# EAGLE design Placa Principal VF (EAGLE 9.7.0)
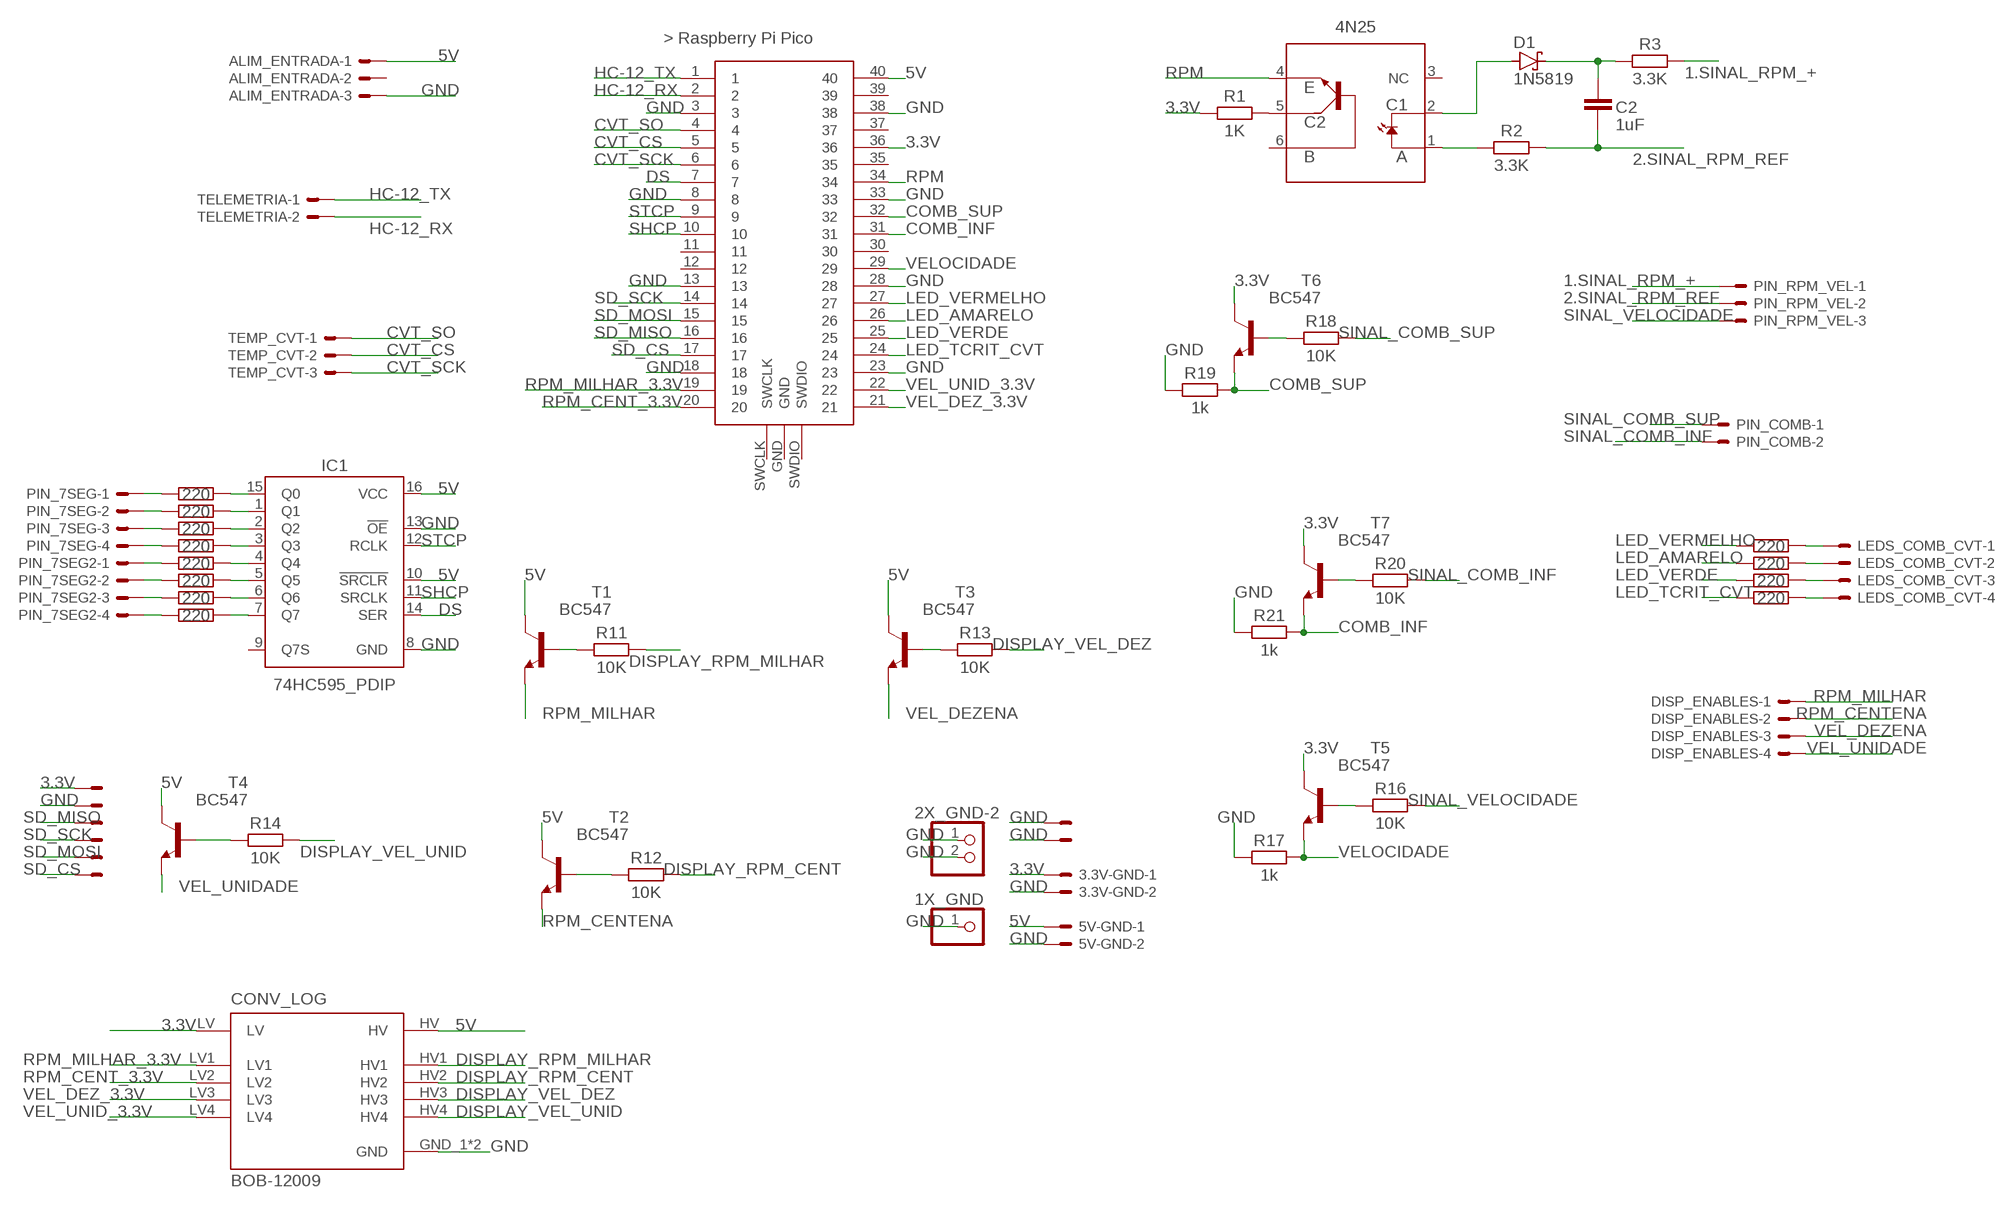
[diagram p0: schematic, sheet 1]

## Parts
1X_GND  PINHD-1X1  [1X01]
2X_GND  JST-XH-02-PIN-ROUND-PAD  [JST-XH-02-PACKAGE-ROUND-PAD]
2X_GND-2  PINHD-1X2  [1X02]
3.3V  JST-XH-02-PIN-ROUND-PAD  [JST-XH-02-PACKAGE-ROUND-PAD]
3.3V-GND  JST-XH-02-PIN-ROUND-PAD  [JST-XH-02-PACKAGE-ROUND-PAD]
4N25  4N25  [DIP762W60P254L712H480Q6B]
5V-GND  JST-XH-02-PIN-ROUND-PAD  [JST-XH-02-PACKAGE-ROUND-PAD]
ALIM_ENTRADA  JST-XH-03-PIN-ROUND-PAD  [JST-XH-03-PACKAGE-ROUND-PAD]
C2  1uF  C_RADIAL-12.5MM-DIA  [CAPRD550W60D1025H1250B]
CONV_LOG  BOB-12009  [CONV_BOB-12009]
D1  1N5819  1N5817-B  [DO41-7.6]
DISP_ENABLES  JST-XH-04-PIN-ROUND-PAD  [JST-XH-04-PACKAGE-ROUND-PAD]
IC1  74HC595_PDIP  [DIP762W53P254L1969H508Q16B]
LEDS_COMB_CVT  JST-XH-04-PIN-ROUND-PAD  [JST-XH-04-PACKAGE-ROUND-PAD]
MOD_SD  JST-XH-04-PIN-ROUND-PAD  [JST-XH-04-PACKAGE-ROUND-PAD]
PIN_7SEG  JST-XH-04-PIN-ROUND-PAD  [JST-XH-04-PACKAGE-ROUND-PAD]
PIN_7SEG2  JST-XH-04-PIN-ROUND-PAD  [JST-XH-04-PACKAGE-ROUND-PAD]
PIN_COMB  JST-XH-02-PIN-ROUND-PAD  [JST-XH-02-PACKAGE-ROUND-PAD]
PIN_RPM_VEL  JST-XH-03-PIN-ROUND-PAD  [JST-XH-03-PACKAGE-ROUND-PAD]
R1  1K  R_AXIAL-7.2MM-PITCH  [RESAD724W46L381D178B]
R2  3.3K  R_AXIAL-7.2MM-PITCH  [RESAD724W46L381D178B]
R3  3.3K  R_AXIAL-7.2MM-PITCH  [RESAD724W46L381D178B]
R4  220  R_AXIAL-7.2MM-PITCH  [RESAD724W46L381D178B]
R5  220  R_AXIAL-7.2MM-PITCH  [RESAD724W46L381D178B]
R6  220  R_AXIAL-7.2MM-PITCH  [RESAD724W46L381D178B]
R7  220  R_AXIAL-7.2MM-PITCH  [RESAD724W46L381D178B]
R8  220  R_AXIAL-7.2MM-PITCH  [RESAD724W46L381D178B]
R9  220  R_AXIAL-7.2MM-PITCH  [RESAD724W46L381D178B]
R10  220  R_AXIAL-7.2MM-PITCH  [RESAD724W46L381D178B]
R11  10K  R_AXIAL-7.2MM-PITCH  [RESAD724W46L381D178B]
R12  10K  R_AXIAL-7.2MM-PITCH  [RESAD724W46L381D178B]
R13  10K  R_AXIAL-7.2MM-PITCH  [RESAD724W46L381D178B]
R14  10K  R_AXIAL-7.2MM-PITCH  [RESAD724W46L381D178B]
R15  220  R_AXIAL-7.2MM-PITCH  [RESAD724W46L381D178B]
R16  10K  R_AXIAL-7.2MM-PITCH  [RESAD724W46L381D178B]
R17  1k  R_AXIAL-7.2MM-PITCH  [RESAD724W46L381D178B]
R18  10K  R_AXIAL-7.2MM-PITCH  [RESAD724W46L381D178B]
R19  1k  R_AXIAL-7.2MM-PITCH  [RESAD724W46L381D178B]
R20  10K  R_AXIAL-7.2MM-PITCH  [RESAD724W46L381D178B]
R21  1k  R_AXIAL-7.2MM-PITCH  [RESAD724W46L381D178B]
R22  220  R_AXIAL-7.2MM-PITCH  [RESAD724W46L381D178B]
R23  220  R_AXIAL-7.2MM-PITCH  [RESAD724W46L381D178B]
R24  220  R_AXIAL-7.2MM-PITCH  [RESAD724W46L381D178B]
R25  220  R_AXIAL-7.2MM-PITCH  [RESAD724W46L381D178B]
T1  BC547  [TO92]
T2  BC547  [TO92]
T3  BC547  [TO92]
T4  BC547  [TO92]
T5  BC547  [TO92]
T6  BC547  [TO92]
T7  BC547  [TO92]
TELEMETRIA  JST-XH-02-PIN-ROUND-PAD  [JST-XH-02-PACKAGE-ROUND-PAD]
TEMP_CVT  JST-XH-03-PIN-ROUND-PAD  [JST-XH-03-PACKAGE-ROUND-PAD]
U$2  RASPBERRY-PI-PICO_TH  [FT_RASPBERRY-PI-PICO_TH]

## Nets
1.SINAL_RPM_+: PIN_RPM_VEL.1 R3.2
2.SINAL_RPM_REF: C2.2 PIN_RPM_VEL.2 R2.2
3.3V: 3.3V-GND.1 3.3V.1 CONV_LOG.LV R1.1 T5.3(C) T6.3(C) T7.3(C) U$2.36
5V: 5V-GND.1 ALIM_ENTRADA.1 CONV_LOG.HV IC1.10(!SRCLR) IC1.16(VCC) T1.3(C) T2.3(C) T3.3(C) T4.3(C) U$2.40
COMB_INF: R21.2 T7.1(E) U$2.31
COMB_SUP: R19.2 T6.1(E) U$2.32
CVT_CS: TEMP_CVT.2 U$2.5
CVT_SCK: TEMP_CVT.3 U$2.6
CVT_SO: TEMP_CVT.1 U$2.4
DISPLAY_RPM_CENT: CONV_LOG.HV2 R12.2
DISPLAY_RPM_MILHAR: CONV_LOG.HV1 R11.2
DISPLAY_VEL_DEZ: CONV_LOG.HV3 R13.2
DISPLAY_VEL_UNID: CONV_LOG.HV4 R14.2
DS: IC1.14(SER) U$2.7
GND: 1X_GND.1 2X_GND-2.1 2X_GND-2.2 2X_GND.1 2X_GND.2 3.3V-GND.2 3.3V.2 5V-GND.2 ALIM_ENTRADA.3 CONV_LOG.GND_1(GND) CONV_LOG.GND_2(GND) IC1.8(GND) IC1.13(!OE) R17.1 R19.1 R21.1 U$2.3 U$2.8 U$2.13 U$2.18 U$2.23 U$2.28 U$2.33 U$2.38
HC-12_RX: TELEMETRIA.2 U$2.2
HC-12_TX: TELEMETRIA.1 U$2.1
LED_AMARELO: R22.1 U$2.26
LED_TCRIT_CVT: R24.1 U$2.24
LED_VERDE: R23.1 U$2.25
LED_VERMELHO: R15.1 U$2.27
N$1: 4N25.2(C1) D1.A
N$2: 4N25.1(A) R2.1
N$3: R16.1 T5.2(B)
N$4: C2.1 D1.C R3.1
N$5: R11.1 T1.2(B)
N$6: 4N25.5(C2) R1.2
N$7: IC1.15(Q0) R4.2
N$8: IC1.1(Q1) R5.2
N$9: IC1.2(Q2) R6.2
N$10: LEDS_COMB_CVT.1 R15.2
N$11: R12.1 T2.2(B)
N$12: IC1.3(Q3) R7.2
N$13: IC1.4(Q4) R8.2
N$14: R13.1 T3.2(B)
N$15: IC1.5(Q5) R9.2
N$16: R18.1 T6.2(B)
N$17: LEDS_COMB_CVT.2 R22.2
N$18: R14.1 T4.2(B)
N$19: IC1.6(Q6) R10.2
N$20: LEDS_COMB_CVT.3 R23.2
N$21: R20.1 T7.2(B)
N$22: LEDS_COMB_CVT.4 R24.2
N$23: IC1.7(Q7) R25.2
N$24: PIN_7SEG.1 R4.1
N$25: PIN_7SEG.2 R5.1
N$26: PIN_7SEG.3 R6.1
N$27: PIN_7SEG.4 R7.1
N$28: PIN_7SEG2.1 R8.1
N$29: PIN_7SEG2.2 R9.1
N$30: PIN_7SEG2.3 R10.1
N$31: PIN_7SEG2.4 R25.1
RPM: 4N25.4(E) U$2.34
RPM_CENT_3.3V: CONV_LOG.LV2 U$2.20
RPM_CENTENA: DISP_ENABLES.2 T2.1(E)
RPM_MILHAR: DISP_ENABLES.1 T1.1(E)
RPM_MILHAR_3.3V: CONV_LOG.LV1 U$2.19
SD_CS: MOD_SD.4 U$2.17
SD_MISO: MOD_SD.1 U$2.16
SD_MOSI: MOD_SD.3 U$2.15
SD_SCK: MOD_SD.2 U$2.14
SHCP: IC1.11(SRCLK) U$2.10
SINAL_COMB_INF: PIN_COMB.2 R20.2
SINAL_COMB_SUP: PIN_COMB.1 R18.2
SINAL_VELOCIDADE: PIN_RPM_VEL.3 R16.2
STCP: IC1.12(RCLK) U$2.9
VEL_DEZ_3.3V: CONV_LOG.LV3 U$2.21
VEL_DEZENA: DISP_ENABLES.3 T3.1(E)
VEL_UNID_3.3V: CONV_LOG.LV4 U$2.22
VEL_UNIDADE: DISP_ENABLES.4 T4.1(E)
VELOCIDADE: R17.2 T5.1(E) U$2.29
Unconnected: 4N25.3(NC) 4N25.6(B) ALIM_ENTRADA.2 IC1.9(Q7S) U$2.11 U$2.12 U$2.30 U$2.35 U$2.37 U$2.39 U$2.GND U$2.SWCLK U$2.SWDIO

## Library data of the parts
1X_GND = Connector:PINHD-1X1: PIN HEADER; CATEGORY: CONNECTOR; SUB-CATEGORY: PIN-HEADER
2X_GND 3.3V 3.3V-GND 5V-GND PIN_COMB TELEMETRIA = Rembrandt Electronics - JST XH Connectors v1-0:JST-XH-02-PIN: JST XH Connector 2 Pin Wire to board connector. Pitch: 2,54 mm, (0.100") Number of pins: 2 Created by Rembrandt Electronics www.rembrandtelectronics.com
2X_GND-2 = Connector:PINHD-1X2: PIN HEADER; CATEGORY: CONNECTOR; SUB-CATEGORY: PIN-HEADER
4N25 = Opto-Electronic:4N: Optocoupler, Phototransistor Output, with Base Connection Datasheet <https://www.vishay.com/docs/83725/4n25.pdf>; CATEGORY: Opto-Electronic; DESCRIPTION: Optoisolator Transistor with Base Output 5000Vrms Channel 6-DIP; MANUFACTURER: Vishay; MPN: 4N25; OPERATING_TEMP: - 55°C to + 100 °C; PART_STATUS: Active; ROHS_COMPLIANT: COMPLIANT; SERIES: 4N2x; SUB-CATEGORY: Optocoupler; THERMALLOSS: 0.150 W
ALIM_ENTRADA PIN_RPM_VEL TEMP_CVT = Rembrandt Electronics - JST XH Connectors v1-0:JST-XH-03-PIN: JST XH Connector 2 Pin Wire to board connector. Pitch: 2,54 mm, (0.100") Number of pins: 3 Created by Rembrandt Electronics www.rembrandtelectronics.com
C2 = Capacitor:C: Capacitor - Generic; CATEGORY: Capacitor
CONV_LOG = BOB-12009:BOB-12009: Logic Level Converter - Bi-Direc; MANUFACTURER: SparkFun Electronics; MAXIMUM_PACKAGE_HEIGHT: N/A; PARTREV: 01; STANDARD: Manufacturer Recommendations
D1 = diode:1N581*: 1.0A SCHOTTKY BARRIER RECTIFIER Source: http://www.diodes.com/datasheets/ds23001.pdf
DISP_ENABLES LEDS_COMB_CVT PIN_7SEG PIN_7SEG2 = Rembrandt Electronics - JST XH Connectors v1-0:JST-XH-04-PIN: JST XH Connector 2 Pin Wire to board connector. Pitch: 2,54 mm, (0.100") Number of pins: 4 Created by Rembrandt Electronics www.rembrandtelectronics.com
IC1 = IC_Logic:74HC595: 8-Bit Shift Registers Reference Datasheet <https://www.ti.com/lit/ds/symlink/sn74hc595.pdf?ts=1637559852861&ref_url=https%253A%252F%252Fwww.google.com%252F>; CATEGORY: IC_Logic; DESCRIPTION: 8-Bit Shift Registers; MANUFACTURER: Generic; MPN: Generic; SUB-CATEGORY: Shift Register; TYPE: 8-bit
MOD_SD = Rembrandt Electronics - JST XH Connectors v1-0:JST-XH-04-PIN: JST XH Connector 2 Pin Wire to board connector. Pitch: 2,54 mm, (0.100") Number of pins: 4 Created by Rembrandt Electronics www.rembrandtelectronics.com; SPICEPREFIX: X
R1-R25 = Resistor:R: Resistor Fixed - Generic; CATEGORY: Resistor; SUB-CATEGORY: Fixed
T1-T7 = transistor:BC547: NPN TRANSISTOR
U$2 = pipico:RASPBERRY-PI-PICO_TH: Raspberry Pi Pico microcontroller board for through-hole mounting.

## Board
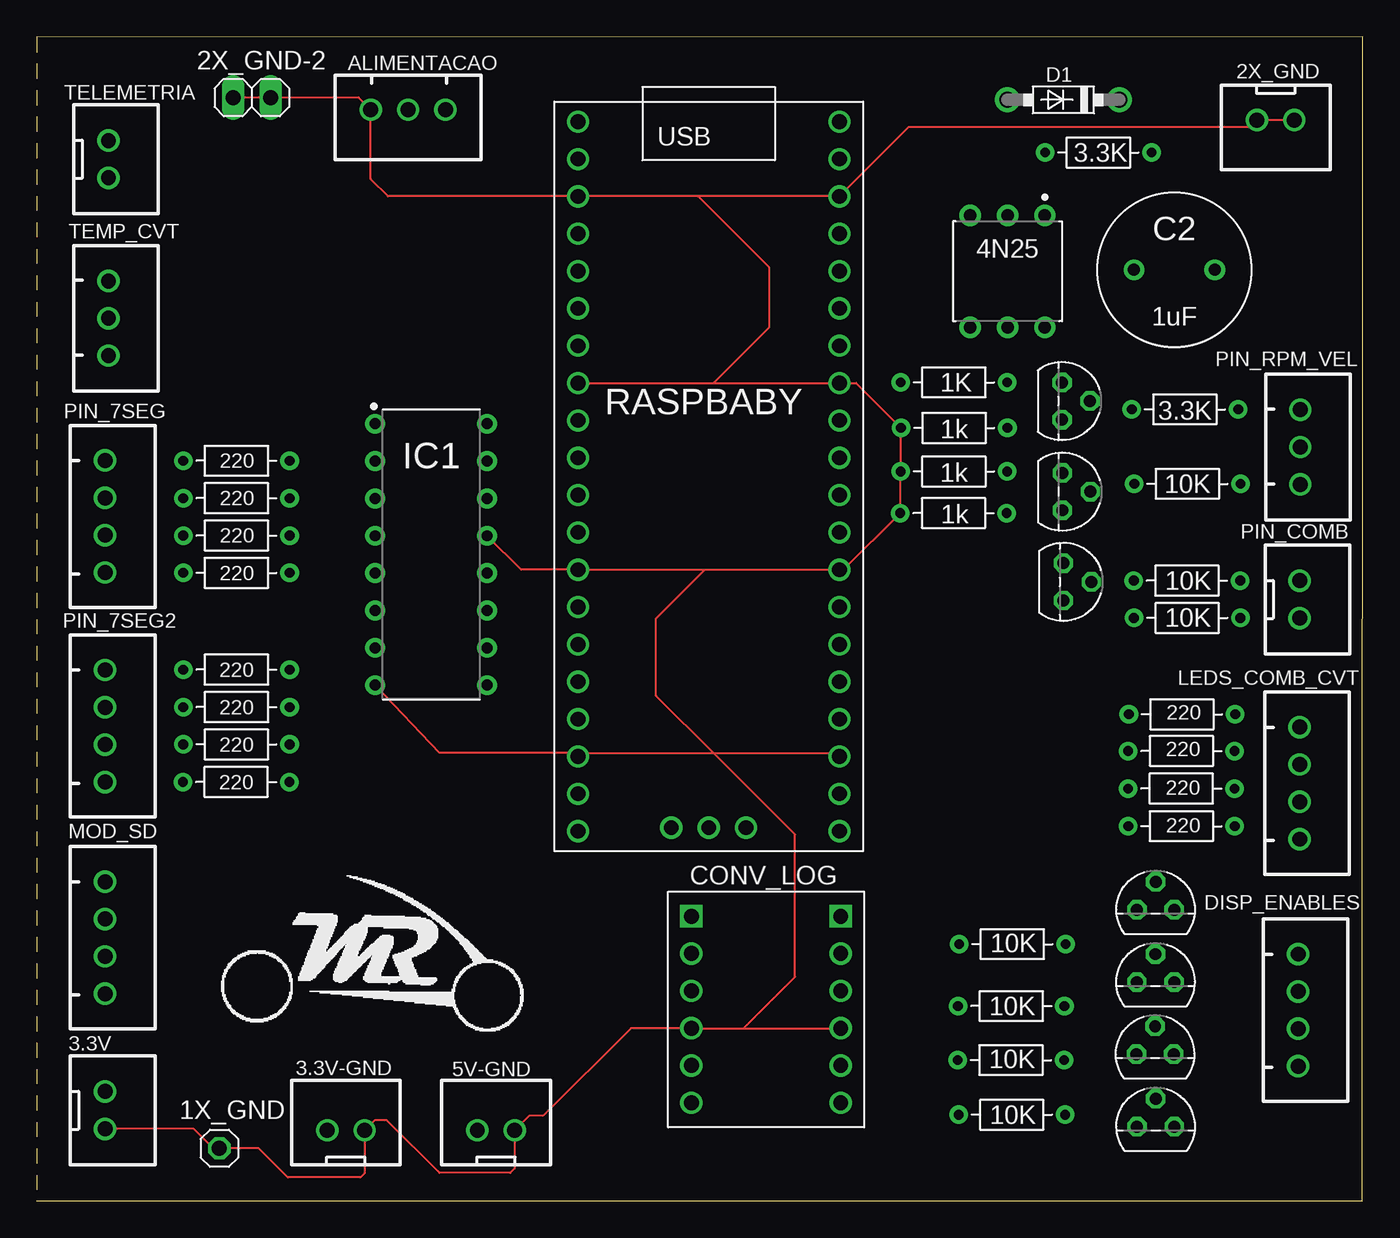
[diagram p1: board, top side]
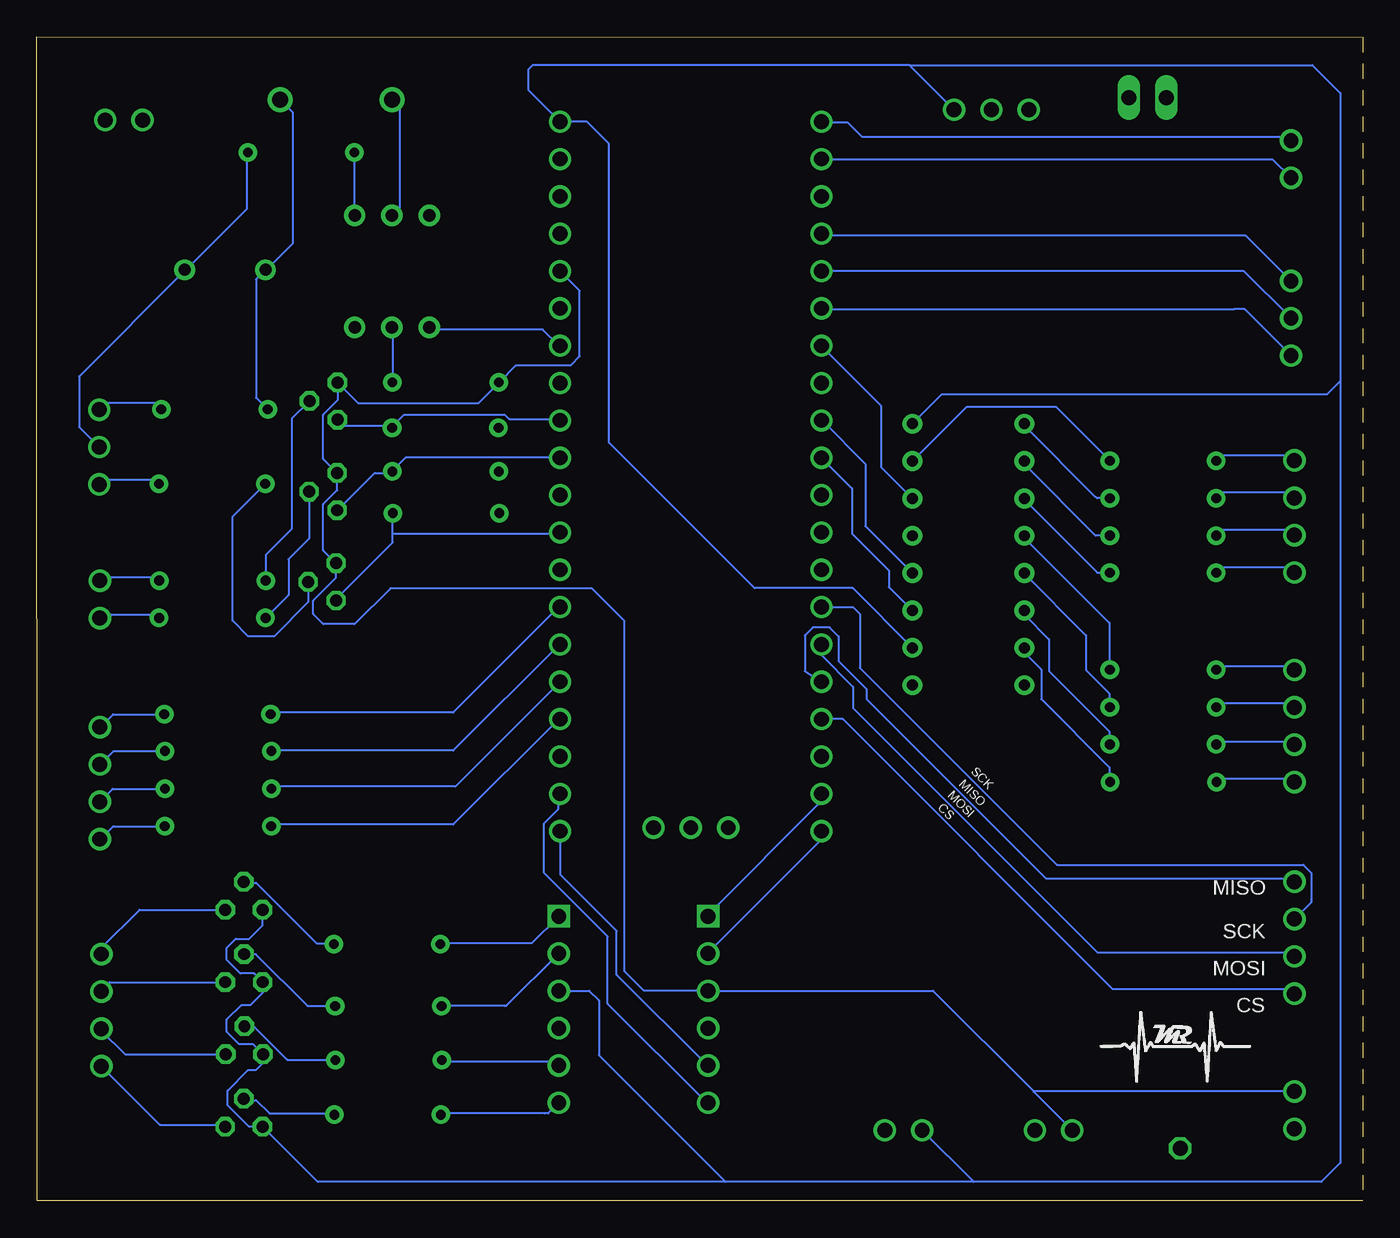
[diagram p2: board, bottom side, seen from below]

Size 90.2 x 79.2 mm. Coordinates in mm from the lower left corner, seen from the top.
Outline: 0,0 90.17,0 90.2,79.2 0,79.15 0,0
Copper layers (1*16): Top / Bottom
Stack-up Default Layer Stack: Top User Defined 0.035mm / Dielectric-1 User Defined 1.5mm / Bottom User Defined 0.035mm
Design rules "default": minimum track width 6mil, minimum drill 0.35mm, track to track 6mil, track to pad 6mil, pad to pad 6mil, via to via 6mil, smd to smd 6mil, copper to edge 40mil, drill to drill 6mil, minimum pad ring 10mil, minimum via ring 8mil, stop-mask expansion 4mil, vias tented up to drill 0mil, thermal gap 10mil

### Footprints (pad centres in the part's own frame; a part is rotated, then mirrored left to right if it is on the bottom)
1X01 = drill 1.016 octagon: 1 0,0
JST-XH-02-PACKAGE-ROUND-PAD = drill 1.016: 1 -1.27,0; 2 1.27,0
1X02 = drill 1.016 long: 1 -1.27,0; 2 1.27,0
DIP762W60P254L712H480Q6B = drill 0.85 pad 1.45: 1 -3.81,2.54; 2 -3.81,0; 3 -3.81,-2.54; 4 3.81,-2.54; 5 3.81,0; 6 3.81,2.54
JST-XH-03-PACKAGE-ROUND-PAD = drill 1.016: 1 -2.54,0; 2 0,0; 3 2.54,0
CAPRD550W60D1025H1250B = drill 0.8 pad 1.4: 1 -2.75,0; 2 2.75,0
CONV_BOB-12009 = drill 1.016: GND_1 5.08,-1.27; GND_2 -5.08,-1.27; HV 5.08,1.27; HV2 5.08,3.81; HV3 5.08,-3.81; HV4 5.08,-6.35; LV -5.08,1.27; LV2 -5.08,3.81; LV3 -5.08,-3.81; LV4 -5.08,-6.35 | drill 1.016 square: HV1 5.08,6.35; LV1 -5.08,6.35
DO41-7.6 = drill 1.1 pad 1.7: A 3.81,0; C -3.81,0
JST-XH-04-PACKAGE-ROUND-PAD = drill 1.016: 1 -3.81,0; 2 -1.27,0; 3 1.27,0; 4 3.81,0
DIP762W53P254L1969H508Q16B = drill 0.743 pad 1.343: 1 -3.81,8.89; 2 -3.81,6.35; 3 -3.81,3.81; 4 -3.81,1.27; 5 -3.81,-1.27; 6 -3.81,-3.81; 7 -3.81,-6.35; 8 -3.81,-8.89; 9 3.81,-8.89; 10 3.81,-6.35; 11 3.81,-3.81; 12 3.81,-1.27; 13 3.81,1.27; 14 3.81,3.81; 15 3.81,6.35; 16 3.81,8.89
RESAD724W46L381D178B = drill 0.66 pad 1.26: 1 -3.62,0; 2 3.62,0
TO92 = drill 0.813 octagon: 1 1.27,0; 2 0,1.905; 3 -1.27,0
FT_RASPBERRY-PI-PICO_TH = drill 1: 1 -8.55,24.03; 2 -8.55,21.49; 3 -8.55,18.95; 4 -8.55,16.41; 5 -8.55,13.87; 6 -8.55,11.33; 7 -8.55,8.79; 8 -8.55,6.25; 9 -8.55,3.71; 10 -8.55,1.17; 11 -8.55,-1.37; 12 -8.55,-3.91; 13 -8.55,-6.45; 14 -8.55,-8.99; 15 -8.55,-11.53; 16 -8.55,-14.07; 17 -8.55,-16.61; 18 -8.55,-19.15; 19 -8.55,-21.69; 20 -8.55,-24.23; 21 9.23,-24.23; 22 9.23,-21.69; 23 9.23,-19.15; 24 9.23,-16.61; 25 9.23,-14.07; 26 9.23,-11.53; 27 9.23,-8.99; 28 9.23,-6.45; 29 9.23,-3.91; 30 9.23,-1.37; 31 9.23,1.17; 32 9.23,3.71; 33 9.23,6.25; 34 9.23,8.79; 35 9.23,11.33; 36 9.23,13.87; 37 9.23,16.41; 38 9.23,18.95; 39 9.23,21.49; 40 9.23,24.03; GND 0.34,-24; SWCLK -2.2,-24; SWDIO 2.88,-24

### Placement (x,y rotation side)
1X_GND  12.42,3.58 0 top
2X_GND  84.28,73.53 180 top
2X_GND-2  14.63,75.06 0 top
3.3V  4.65,6.17 270 top
3.3V-GND  21.03,4.8 0 top
4N25  66.04,63.24 270 top
5V-GND  31.24,4.8 0 top
ALIM_ENTRADA  25.26,74.23 180 top
C2  77.39,63.34 0 top
CONV_LOG  49.61,13.02 0 top
D1  69.84,74.91 180 top
DISP_ENABLES  85.81,12.98 270 top
IC1  26.83,43.98 0 top
LEDS_COMB_CVT  85.91,28.42 270 top
MOD_SD  4.65,17.91 270 top
PIN_7SEG  4.65,46.56 270 top
PIN_7SEG2  4.65,32.31 270 top
PIN_COMB  85.92,40.92 270 top
PIN_RPM_VEL  85.95,51.28 270 top
R1  62.38,55.68 0 top
R2  72.22,71.32 0 top
R3  78.11,53.85 0 top
R4  13.58,50.35 0 top
R5  13.58,47.8 0 top
R6  13.58,45.26 0 top
R7  13.58,42.72 0 top
R8  13.58,36.15 0 top
R9  13.58,33.59 0 top
R10  13.58,31.05 0 top
R11  66.37,17.47 180 top
R12  66.29,13.26 180 top
R13  66.28,9.58 180 top
R14  66.33,5.86 180 top
R15  77.91,33.1 0 top
R16  78.28,48.78 0 top
R17  62.36,46.79 0 top
R18  78.25,42.2 0 top
R19  62.41,52.58 0 top
R20  78.26,39.66 0 top
R21  62.39,49.62 0 top
R22  77.87,30.61 0 top
R23  77.86,28.05 0 top
R24  77.87,25.49 0 top
R25  13.56,28.5 0 top
T1  76.11,19.81 0 top
T2  76.1,14.88 0 top
T3  76.08,9.98 0 top
T4  76.11,5.05 0 top
T5  69.84,42.12 270 top
T6  69.74,54.41 270 top
T7  69.77,48.25 270 top
TELEMETRIA  4.88,70.87 270 top
TEMP_CVT  4.88,60.05 270 top
U$2  45.37,49.39 0 top

### Tracks (layer width: path | path; a pad name or v marks a point on that pad's centre or on a via)
1.SINAL_RPM_+
  Bottom 0.152: PIN_RPM_VEL.1 85.5,54.28 82.22,54.28 82.17,54.28 R3.2
2.SINAL_RPM_REF
  Bottom 0.152: R2.2 75.89,71.17 75.89,67.51 80.01,63.4 C2.2 80.16,63.25 87.33,56.08 87.33,52.65 PIN_RPM_VEL.2
3.3V
  Bottom 0.152: 3.3V.1 22.38,7.44 | 22.38,7.44 29.23,14.29 CONV_LOG.LV 48.89,14.29 50.22,15.63 50.22,39.47 52.43,41.68 66.15,41.68 68.58,39.24 70.71,39.24 71.4,39.93 71.4,40.84 69.84,42.4 T5.3 70.71,44.26 70.71,47.4 69.77,48.34 T7.3 70.71,50.47 70.71,53.49 69.74,54.47 T6.3 68.31,54.25 60.19,54.25 R1.1 57.6,56.84 53.87,56.84 53.26,57.45 53.26,61.92 U$2.36 | 22.38,7.44 22.38,7.42 3.3V-GND.1
5V
  Bottom 0.152: 30.84,77.27 56.46,77.27 56.77,76.96 56.77,75.59 U$2.40 52.77,73.42 51.28,71.93 51.28,51.59 41.38,41.68 34.7,41.68 IC1.10 | 30.84,77.27 3.43,77.27 1.52,75.36 1.52,55.78 | 1.52,55.78 1.52,2.59 2.82,1.29 26.47,1.29 | 26.47,1.29 43.36,1.29 | 43.36,1.29 71.08,1.29 T4.3 75.77,5.05 77.23,6.51 77.23,7.51 75.82,8.91 75.29,8.91 74.81,9.4 T3.3 75.49,10.67 76.43,10.67 77.27,11.51 77.27,12.34 76.28,13.34 75.67,13.34 74.83,14.17 T2.3 75.42,15.47 76.35,15.47 77.27,16.38 77.27,17.22 76.66,17.83 75.74,17.83 74.84,18.73 T1.3 | ALIM_ENTRADA.1 30.84,77.27 | 1.52,55.78 2.44,54.86 28.65,54.86 IC1.16 | 5V-GND.1 26.47,1.29 | CONV_LOG.HV 52.63,14.29 51.97,13.63 51.97,9.91 43.36,1.29
COMB_INF
  Bottom 0.152: T7.1 69.65,47.09 67.21,49.53 66.14,49.53 R21.2 65.99,49.68 65.08,50.6 54.71,50.6 U$2.31
COMB_SUP
  Bottom 0.152: T6.1 69.65,53.03 69.34,52.73 66.14,52.73 R19.2 65.99,52.73 65.23,53.49 58.37,53.49 58.06,53.19 54.71,53.19 U$2.32
CVT_CS
  Bottom 0.152: TEMP_CVT.2 8.08,63.25 36.73,63.25 U$2.5
CVT_SCK
  Bottom 0.152: U$2.6 36.73,60.66 9.22,60.66 8.76,60.66 8.03,60.66 TEMP_CVT.3
CVT_SO
  Bottom 0.152: U$2.4 36.73,65.68 7.98,65.68 TEMP_CVT.1
DISPLAY_RPM_CENT
  Bottom 0.152: R12.2 62.64,13.26 58.37,13.26 58.26,13.26 CONV_LOG.HV2
DISPLAY_RPM_MILHAR
  Bottom 0.152: R11.2 62.64,17.53 56.62,17.53 56.54,17.53 56.53,17.53 CONV_LOG.HV1
DISPLAY_VEL_DEZ
  Bottom 0.152: R13.2 62.64,9.45 55.09,9.45 54.93,9.45 CONV_LOG.HV3
DISPLAY_VEL_UNID
  Bottom 0.152: R14.2 62.64,5.94 55.63,5.94 55.42,5.94 CONV_LOG.HV4
DS
  Bottom 0.152: IC1.14 32.77,49.91 32.77,54.1 36.73,58.06 U$2.7
GND
  Top 0.152: 3.3V.2 4.66,4.92 10.67,4.92 12,3.58 1X_GND.1 15.09,3.58 17.07,1.6 22.02,1.6 22.3,1.88 3.3V-GND.2 22.99,5.49 23.81,5.49 27.39,1.91 32.21,1.91 32.51,2.21 5V-GND.2 33.5,5.79 34.45,5.79 40.41,11.75 CONV_LOG.GND_2 44.77,11.75 48.08,11.75 | 48.08,11.75 54.61,11.75 CONV_LOG.GND_1 | IC1.8 27.41,30.48 36.51,30.48 U$2.18 36.83,30.48 46.02,30.48 | 46.02,30.48 54.29,30.48 U$2.23 | 46.02,30.48 51.59,24.92 51.59,15.25 48.08,11.75 | 46.02,30.48 42.14,34.37 42.14,39.62 45.45,42.94 | 45.45,42.94 U$2.13 32.95,42.94 IC1.13 | 45.45,42.94 U$2.28 54.88,42.94 R17.1 58.74,49.53 R21.1 58.77,52.56 R19.1 55.73,55.64 U$2.33 46.02,55.64 | U$2.8 46.02,55.64 | 44.97,68.34 U$2.38 59.31,73.05 82.52,73.05 2X_GND.2 2X_GND.1 | 44.97,68.34 U$2.3 23.89,68.34 22.72,69.51 ALIM_ENTRADA.3 21.9,75.06 2X_GND-2.2 2X_GND-2.1 | 46.02,55.64 49.84,59.45 49.84,63.48 44.97,68.34
HC-12_RX
  Bottom 0.152: U$2.2 36.73,70.87 6.15,70.87 TELEMETRIA.2
HC-12_TX
  Bottom 0.152: U$2.1 36.79,73.38 35.05,73.38 34.06,72.39 5.13,72.39 TELEMETRIA.1
LED_AMARELO
  Bottom 0.152: R22.1 74.22,30.63 61.87,30.63 54.71,37.8 U$2.26
LED_TCRIT_CVT
  Bottom 0.152: R24.1 74.22,25.6 61.87,25.6 54.71,32.77 U$2.24
LED_VERDE
  Bottom 0.152: R23.1 74.22,28.19 61.72,28.19 54.71,35.2 U$2.25
LED_VERMELHO
  Bottom 0.152: R15.1 74.22,33.22 61.87,33.22 54.71,40.39 U$2.27
N$1
  Bottom 0.152: D1.A 65.49,74.38 65.49,67.67 65.49,67.59 4N25.2
N$2
  Bottom 0.152: R2.1 68.58,71.17 4N25.1
N$3
  Bottom 0.152: T5.2 71.74,40.73 74.07,38.41 75.82,38.41 76.89,39.47 76.89,46.56 R16.1
N$4
  Bottom 0.152: D1.C 72.77,74.03 72.77,65.15 74.52,63.4 C2.1 75.29,62.7 75.29,54.64 R3.1
N$5
  Bottom 0.152: R11.1 70.1,17.53 71.17,17.53 75.29,21.64 76.05,21.64 T1.2
N$6
  Bottom 0.152: R1.2 65.99,55.78 65.99,59.28 4N25.5
N$7
  Bottom 0.152: IC1.15 26.94,54.03 20.88,54.03 R4.2
N$8
  Bottom 0.152: IC1.1 23.01,52.73 18.17,47.89 18.09,47.8 R5.2
N$9
  Bottom 0.152: R6.2 18.19,45.26 22.93,50.01 IC1.2
N$10
  Bottom 0.152: R15.2 85.01,33.1 85.8,32.31 LEDS_COMB_CVT.1
N$11
  Bottom 0.152: T2.2 75.31,16.79 71.78,13.26 69.95,13.26 R12.1
N$12
  Bottom 0.152: R7.2 17.21,42.75 18.06,42.75 23.01,47.7 IC1.3
N$13
  Bottom 0.152: R8.2 17.22,36.27 17.22,39.32 23.01,45.11 IC1.4
N$14
  Bottom 0.152: R13.1 69.95,9.6 73.17,9.6 75.45,11.89 T3.2
N$15
  Bottom 0.152: R9.2 17.22,33.68 17.22,34.52 18.82,36.12 18.82,38.48 23.01,42.67 IC1.5
N$16
  Bottom 0.152: T6.2 72.85,53.21 72.85,45.72 74.63,43.94 R18.1
N$17
  Bottom 0.152: R22.2 84.96,30.61 85.87,29.7 LEDS_COMB_CVT.2
N$18
  Bottom 0.152: R14.1 69.95,5.94 74.37,5.94 75.29,6.86 76.05,6.86 T4.2
N$19
  Bottom 0.152: R10.2 17.22,31.09 17.22,31.93 21.34,36.04 21.34,38.2 23.02,39.89 IC1.6
N$20
  Bottom 0.152: R23.2 81.53,28.04 85.04,28.04 85.8,27.28 LEDS_COMB_CVT.3
N$21
  Bottom 0.152: R20.1 73.08,41.22 73.08,43.66 71.67,45.07 T7.2
N$22
  Bottom 0.152: 85,25.49 R24.2 | 85,25.49 | 85,25.49 85.8,24.69 LEDS_COMB_CVT.4
N$23
  Bottom 0.152: R25.2 17.22,28.5 17.22,29.49 21.87,34.14 21.87,36.15 23.02,37.3 IC1.7
N$24
  Bottom 0.152: R4.1 9.58,50.73 5.01,50.73 PIN_7SEG.1
N$25
  Bottom 0.152: PIN_7SEG.2 5.03,48.21 9.45,48.21 9.56,48.21 R5.1
N$26
  Bottom 0.152: PIN_7SEG.3 5.03,45.67 9.37,45.67 9.56,45.67 R6.1
N$27
  Bottom 0.152: PIN_7SEG.4 5.03,43.13 9.53,43.13 9.68,42.98 9.71,42.98 R7.1
N$28
  Bottom 0.152: PIN_7SEG2.1 4.88,36.35 9.76,36.35 R8.1
N$29
  Bottom 0.152: R9.1 9.8,33.83 4.84,33.83 PIN_7SEG2.2
N$30
  Bottom 0.152: R10.1 9.65,31.24 4.95,31.24 PIN_7SEG2.3
N$31
  Bottom 0.152: PIN_7SEG2.4 4.88,28.73 9.71,28.73 R25.1
RPM
  Bottom 0.152: 4N25.4 63.4,59.28 55.78,59.28 54.71,58.22 U$2.34
RPM_CENT_3.3V
  Bottom 0.152: U$2.20 36.88,25.15 36.88,24.54 44.5,16.92 CONV_LOG.LV2
RPM_CENTENA
  Bottom 0.152: T2.1 85.24,14.88 85.8,14.33 DISP_ENABLES.2
RPM_MILHAR
  Bottom 0.152: T1.1 83.21,19.81 85.81,17.22 DISP_ENABLES.1
RPM_MILHAR_3.3V
  Bottom 0.152: U$2.19 36.88,27.58 36.88,27.13 44.5,19.51 CONV_LOG.LV1
SD_CS
  Bottom 0.152: MOD_SD.4 4.95,14.4 16.99,14.4 35.37,32.78 U$2.17
SD_MISO
  Bottom 0.152: U$2.16 37.95,36.05 37.95,38.48 37.41,39.01 36.27,39.01 35.66,38.41 35.66,36.73 33.76,34.82 33.76,34.14 21.57,21.95 4.88,21.95 MOD_SD.1
SD_MOSI
  Bottom 0.152: U$2.15 36.82,37.12 34.67,34.98 34.67,33.53 18.06,16.92 5.11,16.92 4.93,16.92 MOD_SD.3
SD_SCK
  Bottom 0.152: U$2.14 34.68,40.4 34.21,39.93 34.21,36.27 20.8,22.86 4.04,22.86 3.5,22.33 3.5,20.5 3.5,20.32 MOD_SD.2
SHCP
  Bottom 0.152: 32.23,41.76 32.23,42.9 34.75,45.41 34.75,48.46 36.73,50.44 U$2.10 | 32.23,41.76 | 32.23,41.76 IC1.11
SINAL_COMB_INF
  Bottom 0.152: PIN_COMB.2 85.68,39.88 85.69,39.89 82.1,39.89 R20.2
SINAL_COMB_SUP
  Bottom 0.152: 85.68,42.43 82.1,42.43 R18.2 | PIN_COMB.1 85.68,42.43 | 85.68,42.43
SINAL_VELOCIDADE
  Bottom 0.152: R16.2 82.2,49.09 85.57,49.09 85.61,49.09 PIN_RPM_VEL.3
STCP
  Bottom 0.152: IC1.12 33.83,45.9 33.83,50.14 36.73,53.03 U$2.9
VEL_DEZ_3.3V
  Bottom 0.152: U$2.21 54.56,25.15 54.56,22.17 50.75,18.36 50.75,15.39 44.65,9.3 CONV_LOG.LV3
VEL_DEZENA
  Bottom 0.152: T3.1 84.2,9.98 85.8,11.58 DISP_ENABLES.3
VEL_UNID_3.3V
  Bottom 0.152: U$2.22 54.71,27.58 54.71,26.67 55.7,25.68 55.7,22.33 51.36,17.98 51.36,13.41 44.65,6.71 CONV_LOG.LV4
VEL_UNIDADE
  Bottom 0.152: T4.1 77.42,5.18 81.84,5.18 85.8,9.14 DISP_ENABLES.4
VELOCIDADE
  Bottom 0.152: 65.99,45.41 65.99,44.81 69.8,41 T5.1 | 65.99,45.41 R17.2 | 65.99,45.41 54.71,45.41 U$2.29

### Text on the board
bPlace: SCK | MISO | MOSI | CS | MISO | SCK | MOSI | CS